# Altium schematic sheet motor_control.SchDoc: Fault-Tolerant Quadcopter
size A; DrawnBy: Vaughn Kottler; Engineer: Vaughn Kottler; Revision: A
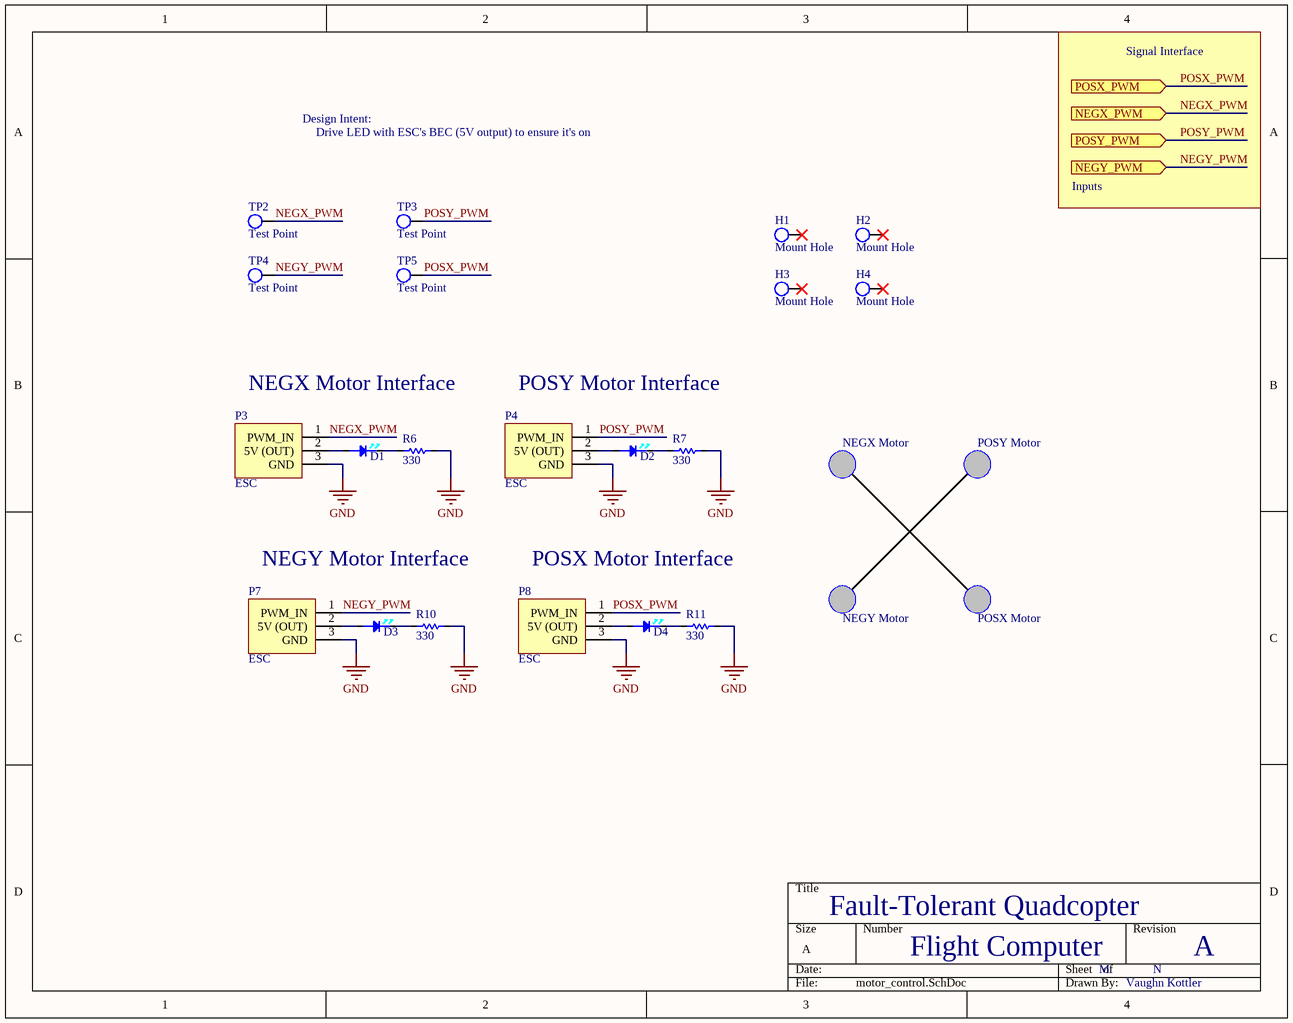
[diagram p0: motor_control.SchDoc]

## Parts
D1  LED-WHT-20mA  [LED-0805]  (value not drawn)
D2  LED-WHT-20mA  [LED-0805]  (value not drawn)
D3  LED-WHT-20mA  [LED-0805]  (value not drawn)
D4  LED-WHT-20mA  [LED-0805]  (value not drawn)
H1  Mount Hole  [4mm Mount Hole]
H2  Mount Hole  [4mm Mount Hole]
H3  Mount Hole  [4mm Mount Hole]
H4  Mount Hole  [4mm Mount Hole]
P3  ESC  [ESC RA]
P4  ESC  [ESC RA]
P7  ESC  [ESC RA]
P8  ESC  [ESC RA]
R6  330  [RES-0805]
R7  330  [RES-0805]
R10  330  [RES-0805]
R11  330  [RES-0805]
TP2  Test Point  [0603 Test Point]
TP3  Test Point  [0603 Test Point]
TP4  Test Point  [0603 Test Point]
TP5  Test Point  [0603 Test Point]

## Ports
NEGX_PWM (in), NEGY_PWM (in), POSX_PWM (in), POSY_PWM (in)

## Nets
GND: P3.3(GND) P4.3(GND) P7.3(GND) P8.3(GND) R6.2 R7.2 R10.2 R11.2
NEGX_PWM: P3.1(PWM_IN) TP2.1 ; port NEGX_PWM
NEGY_PWM: P7.1(PWM_IN) TP4.1 ; port NEGY_PWM
POSX_PWM: P8.1(PWM_IN) TP5.1 ; port POSX_PWM
POSY_PWM: P4.1(PWM_IN) TP3.1 ; port POSY_PWM
NetD1_1: D1.1(CT) P3.2(5V_(OUT))
NetD1_2: D1.2(AN) R6.1
NetD2_1: D2.1(CT) P4.2(5V_(OUT))
NetD2_2: D2.2(AN) R7.1
NetD3_1: D3.1(CT) P7.2(5V_(OUT))
NetD3_2: D3.2(AN) R10.1
NetD4_1: D4.1(CT) P8.2(5V_(OUT))
NetD4_2: D4.2(AN) R11.1

Not connected (* = marked no-connect by the designer): H1 H*; H2 H*; H3 H*; H4 H*

## Notes on the sheet
- Signal Interface
- Design Intent:
- Drive LED with ESC's BEC (5V output) to ensure it's on
- Inputs
- NEGX Motor Interface
- POSY Motor Interface
- NEGX Motor
- POSY Motor
- NEGY Motor Interface
- POSX Motor Interface
- NEGY Motor
- POSX Motor
- Flight Computer
- M
- N

## Library data of the parts
D1-D4 = LED-WHT-20mA: 2.2V, 0805; ComponentLink1Description: Resistor Book (Amazon); ComponentLink1URL: https://www.amazon.com/gp/product/B071J21FYF/; Supplier 1: Digi-Key; Supplier Part Number 1: 475-1410-1-ND
P3 P4 P7 P8 = ESC: PWM Interface, 0.1" Pitch 1x3; ComponentLink1Description: ESC + Motor Combo (Amazon); ComponentLink1URL: https://www.amazon.com/Hobbypower-1000kv-Brushless-Multicopter-Quadcopter/dp/B00E7LG85O/
R6 R7 R10 R11 = RES-330-1/8W: 0805; ComponentLink1Description: Resistor Book (Amazon); ComponentLink1URL: https://www.amazon.com/gp/product/B071J21FYF/
TP2-TP5 = Test Point: 0603; Supplier 1: Digi-Key; Supplier Part Number 1: A106145DKR-ND